# EAGLE design curtains (EAGLE 9.6.2)
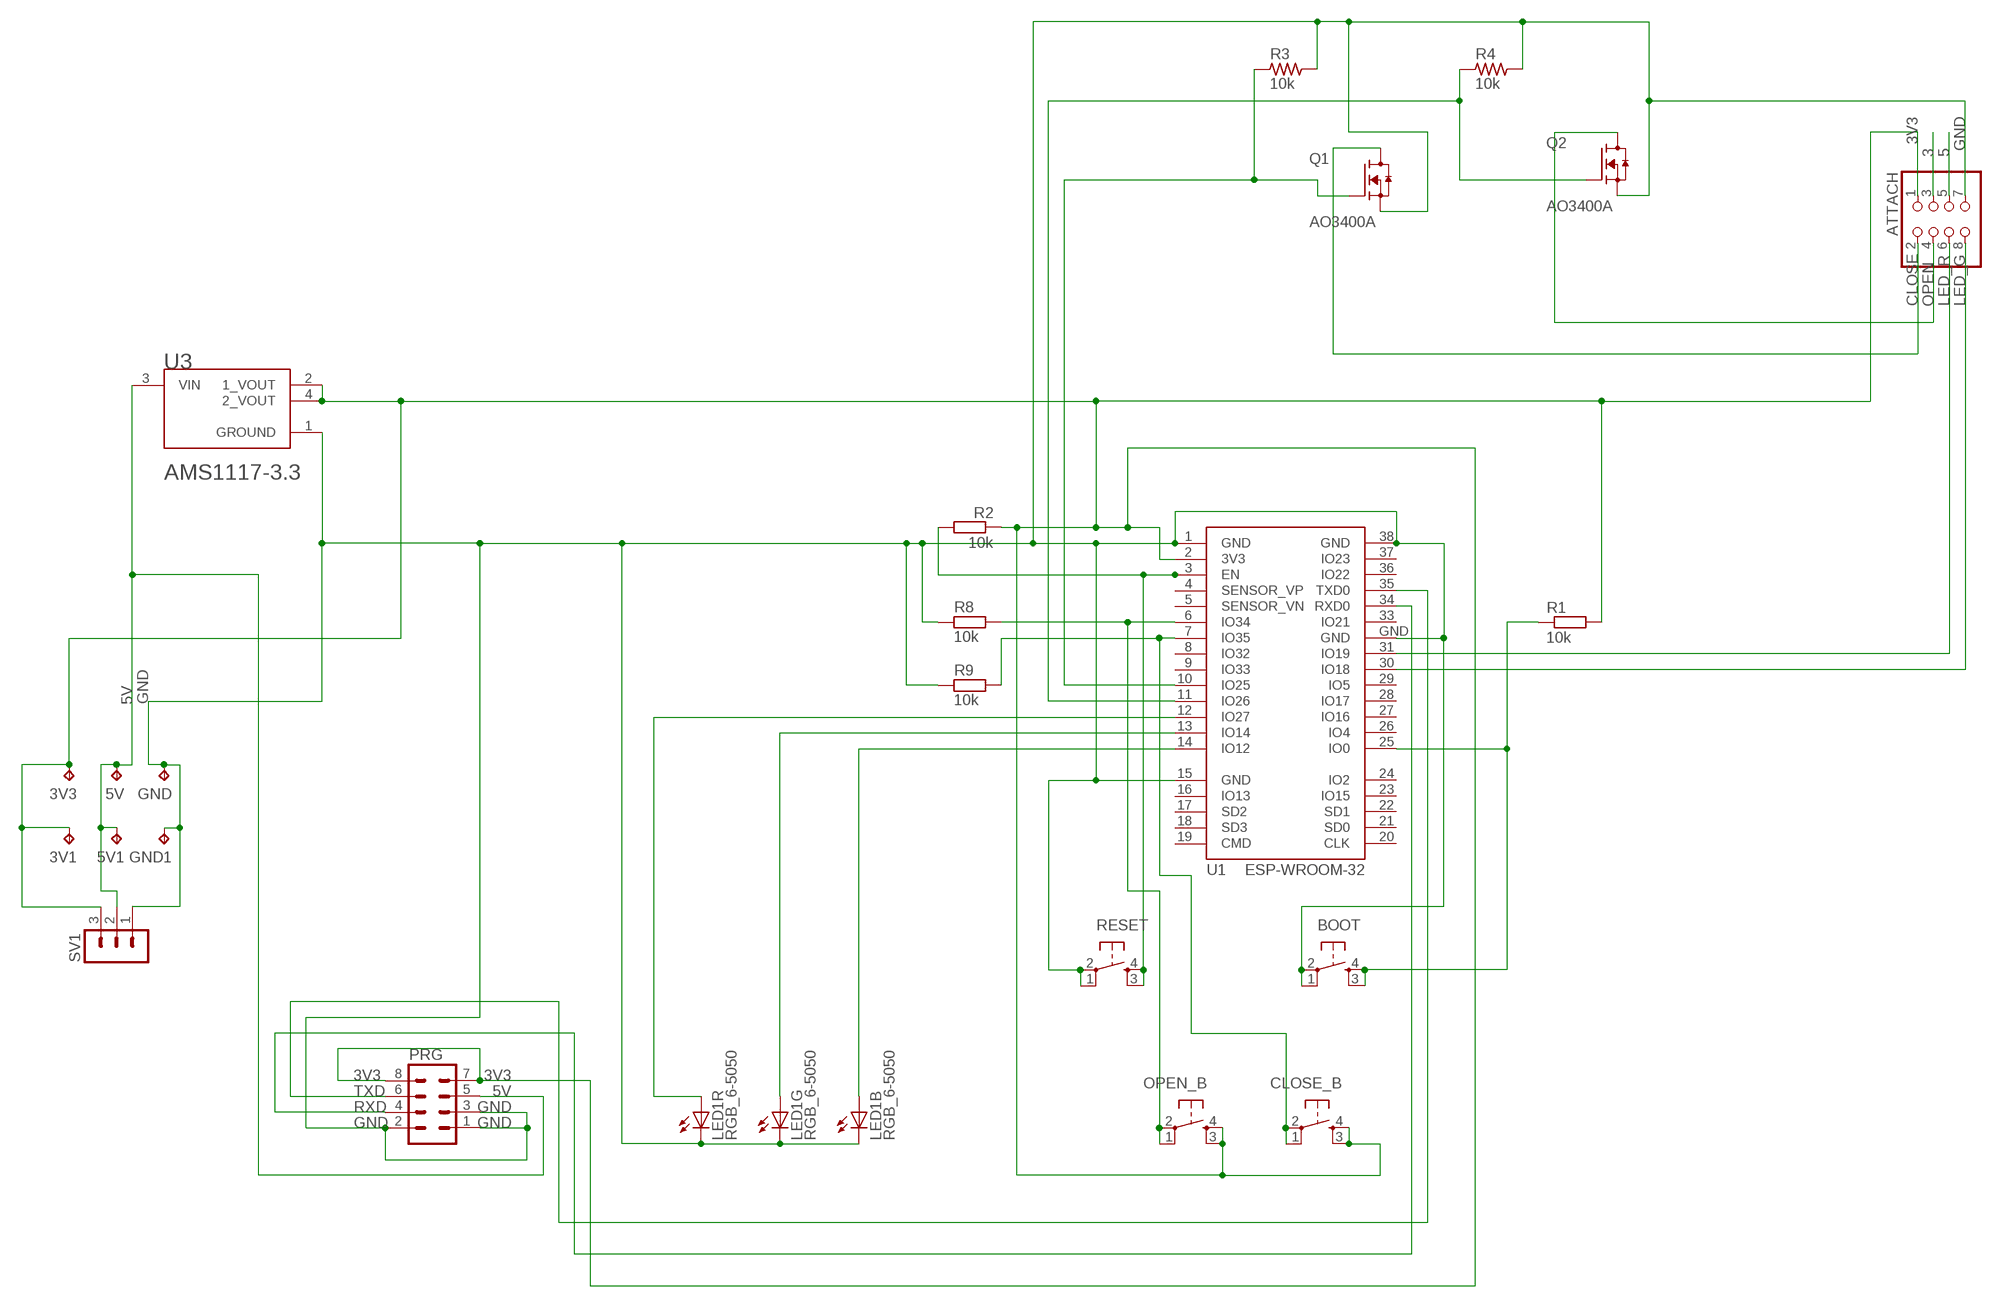
[diagram p0: schematic, sheet 1]

## Parts
3V1  TPB1,27  [B1,27]
3V3  TPB1,27  [B1,27]
5V  TPB1,27  [B1,27]
5V1  TPB1,27  [B1,27]
ATTACH  PINHD-2X4  [2X04]
BOOT  10-XX4X4SMD  [BT4X4]
CLOSE_B  10-XX4X4SMD  [BT4X4]
GND  TPB1,27  [B1,27]
GND1  TPB1,27  [B1,27]
LED1  RGB_6-5050  [5050_PLCC6]
OPEN_B  10-XX4X4SMD  [BT4X4]
PRG  MA04-2  [MA04-2]
Q1  AO3400A  [SOT95P280X125-3N]
Q2  AO3400A  [SOT95P280X125-3N]
R1  10k  R-EU_R0603  [R0603]
R2  10k  R-EU_R0603  [R0603]
R3  10k  RC-MASTER-SMD_R_0603MP  [RC-MASTER-SMD_R0603MP]
R4  10k  RC-MASTER-SMD_R_0603MP  [RC-MASTER-SMD_R0603MP]
R8  10k  R_0603  [R0603]
R9  10k  R_0603  [R0603]
RESET  10-XX4X4SMD  [BT4X4]
SV1  MA03-1  [MA03-1]
U1  ESP-WROOM-32  [ESP-WROOM-32]
U3  ADVANCED_MONOLITHIC_SYSTEMS_AMS1117-3.3ADVANCED_MONOLITHIC_SYSTEMS_AMS1117-3.3_0_0  [ADVANCED_MONOLITHIC_SYSTEMS_AMS1117-3.3_0]

## Nets
3: ATTACH.3
3V3: 3V1.TP 3V3.TP ATTACH.1 CLOSE_B.3(S1) CLOSE_B.4(S) OPEN_B.3(S1) OPEN_B.4(S) PRG.7 PRG.8 R1.2 R2.1 SV1.3 U1.2(3V3) U3.2(1_VOUT) U3.4(2_VOUT)
5: ATTACH.5
5V: 5V1.TP 5V.TP PRG.5 SV1.2 U3.3(VIN)
CLOSE: ATTACH.2 Q1.3(D)
GND: ATTACH.7 BOOT.1 BOOT.2(P) GND1.TP GND.TP LED1.4(B:C) LED1.5(G:C) LED1.6(R:C) PRG.1 PRG.2 PRG.3 Q1.2(S) Q2.2(S) R3.2 R4.2 R8.1 R9.1 RESET.1 RESET.2(P) SV1.1 U1.1(GND) U1.15(GND) U1.38(GND) U1.GND U3.1(GROUND)
LED_G: ATTACH.8 U1.30(IO18)
LED_R: ATTACH.6 U1.31(IO19)
N$1: BOOT.3(S1) BOOT.4(S) R1.1 U1.25(IO0)
N$2: OPEN_B.1 OPEN_B.2(P) R8.2 U1.6(IO34)
N$3: R2.2 RESET.3(S1) RESET.4(S) U1.3(EN)
N$4: Q1.1(G) R3.1 U1.10(IO25)
N$5: Q2.1(G) R4.1 U1.11(IO26)
N$7: LED1.2(G:A) U1.13(IO14)
N$8: LED1.3(B:A) U1.14(IO12)
N$10: CLOSE_B.1 CLOSE_B.2(P) R9.2 U1.7(IO35)
N$11: LED1.1(R:A) U1.12(IO27)
OPEN: ATTACH.4 Q2.3(D)
RXD: PRG.4 U1.34(RXD0)
TXD: PRG.6 U1.35(TXD0)
Unconnected: U1.4(SENSOR_VP) U1.5(SENSOR_VN) U1.8(IO32) U1.9(IO33) U1.16(IO13) U1.17(SD2) U1.18(SD3) U1.19(CMD) U1.20(CLK) U1.21(SD0) U1.22(SD1) U1.23(IO15) U1.24(IO2) U1.26(IO4) U1.27(IO16) U1.28(IO17) U1.29(IO5) U1.33(IO21) U1.36(IO22) U1.37(IO23)

## Library data of the parts
3V1 3V3 5V 5V1 GND GND1 = testpad:TP: Test pad
ATTACH = adafruit:PINHD-2X4: PIN HEADER
BOOT CLOSE_B OPEN_B RESET = buttons:10-XX: OMRON SWITCH
LED1 = led:RGB_6: RGB LED 6000mcd http://tuxotronic.org/mirror/led_rgb/
PRG = con-lstb:MA04-2: PIN HEADER; OC_FARNELL: unknown; OC_NEWARK: unknown
Q1 Q2 = AO3400A:AO3400A: Trans MOSFET N-CH 30V 5.7A 3-Pin SOT-23 Check availability <https://pricing.snapeda.com/parts/AO3400A/Alpha%20%26%20Omega%20Semiconductor%20Inc./view-part?ref=eda>; AVAILABILITY: In Stock; DESCRIPTION: N-Channel 30 V 5.7A (Ta) 1.4W (Ta) Surface Mount SOT-23-3; MF: Alpha & Omega Semiconductor Inc.; MP: AO3400A; PACKAGE: None; PRICE: None; PURCHASE-URL: https://pricing.snapeda.com/search/part/AO3400A/?ref=eda
R1 = resistor:R-EU_: RESISTOR, European symbol
R2 = resistor:R-EU_: RESISTOR, European symbol; RESISTANCE: 10K
R3 R4 = 52101-101-REV-A_v16:RC-MASTER-SMD_R_: RESISTOR
R8 R9 = rc-master:R_: RESISTOR
SV1 = con-lstb:MA03-1: PIN HEADER; OC_FARNELL: unknown; OC_NEWARK: unknown
U1 = esp32:ESP-WROOM-32: Espressif Systems ESP-WROOM-32
U3 = Advanced Monolithic Systems - AMS1117-3.3:ADVANCED_MONOLITHIC_SYSTEMS_AMS1117-3.3: LDO Voltage Regulators 1A, 3.3V; AUTOMOTIVE: No; CENTROID_NOT_SPECIFIED: No; DATASHEET: http://www.advanced-monolithic.com/pdf/ds1117.pdf; DEVICE_CLASS_L1: Integrated Circuits (ICs); DEVICE_CLASS_L2: Power Management ICs; DEVICE_CLASS_L3: Voltage Regulators - Linear; DROPOUT_VOLTAGE: 1.1V; FOOTPRINT_PARAMETERS_0: {"fp_type":"SOT223","params":{"N":{"default":"4","long name":"Number of leads","type":"multichoice","short name":"N"},"A":{"nom":false,"long name":"Height","min":false,"max":1800000,"short name":"A","type":"measurement"},"A1":{"nom":false,"long name":"Standoff height","min":640000,"max":840000,"short name":"A1","type":"measurement"},"A2":{"nom":false,"long name":"Package height","min":1160000,"max":false,"short name":"A2","type":"measurement"},"D":{"nom":false,"long name":"Package length","min":6300000,"max":6710000,"short name":"D","type":"measurement"},"E":{"nom":false,"long name":"Width /w leads","min":6710000,"max":7290000,"short name":"E","type":"measurement"},"E1":{"nom":false,"long name":"Package width","min":3300000,"max":3710000,"short name":"E1","type":"measurement"},"B":{"nom":false,"long name":"Lead width","min":640000,"max":840000,"short name":"B","type":"measurement"},"B2":{"nom":false,"long name":"Thermal lead width","min":2950000,"max":3150000,"short name":"B2","type":"measurement"},"C":{"nom":false,"long name":"Lead thickness","min":250000,"max":360000,"short name":"C","type":"measurement"},"L":{"nom":false,"long name":"Lead foot length","min":310000,"max":false,"short name":"L","type":"measurement"},"e":{"nom":2290000,"long name":"Lead pitch","min":null,"max":null,"short name":"e","type":"measurement"},"PHI":{"nom":false,"long name":"Lead angle","min":false,"max":10000000,"short name":"PHI","type":"measurement"},"offset x":{"nom":0,"long name":"X Center offset","min":null,"max":null,"short name":"offset x","type":"measurement"},"offset y":{"nom":0,"long name":"Y Center offset","min":null,"max":null,"short name":"offset y","type":"measurement"},"LS":{"default":"Rounded rectangle","long name":"Land shape","type":"multichoice","short name":"LS"},"LS1":{"default":"Rectangle","long name":"Land shape (Pin 1)","type":"multichoice","short name":"LS1"},"solder toe":{"nom":550000,"long name":"Solder fillet (toe)","min":null,"max":null,"short name":"solder toe","type":"fixedmeasurement"},"solder heel":{"nom":450000,"long name":"Solder fillet (heel)","min":null,"max":null,"short name":"solder heel","type":"fixedmeasurement"},"solder side":{"nom":50000,"long name":"Solder fillet (side)","min":null,"max":null,"short name":"solder side","type":"fixedmeasurement"},"courtyard":{"nom":500000,"long name":"Courtyard","min":null,"max":null,"short name":"courtyard","type":"fixedmeasurement"},"SF":{"default":"A","long name":"Packing level","type":"multichoiceparent","short name":"SF","help":"http://support.upverter.com/customer/portal/articles/978783-what-is-a-footprint-packing-level","children":["solder toe","solder heel","solder side","courtyard"]}}}; FOOTPRINT_PARAMETERS_1: {"fp_type":"SOT223","params":{"N":{"default":"4","long name":"Number of leads","type":"multichoice","short name":"N"},"A":{"nom":false,"long name":"Height","min":false,"max":1800000,"short name":"A","type":"measurement"},"A1":{"nom":false,"long name":"Standoff height","min":640000,"max":840000,"short name":"A1","type":"measurement"},"A2":{"nom":false,"long name":"Package height","min":1160000,"max":false,"short name":"A2","type":"measurement"},"D":{"nom":false,"long name":"Package length","min":6300000,"max":6710000,"short name":"D","type":"measurement"},"E":{"nom":false,"long name":"Width /w leads","min":6710000,"max":7290000,"short name":"E","type":"measurement"},"E1":{"nom":false,"long name":"Package width","min":3300000,"max":3710000,"short name":"E1","type":"measurement"},"B":{"nom":false,"long name":"Lead width","min":640000,"max":840000,"short name":"B","type":"measurement"},"B2":{"nom":false,"long name":"Thermal lead width","min":2950000,"max":3150000,"short name":"B2","type":"measurement"},"C":{"nom":false,"long name":"Lead thickness","min":250000,"max":360000,"short name":"C","type":"measurement"},"L":{"nom":false,"long name":"Lead foot length","min":310000,"max":false,"short name":"L","type":"measurement"},"e":{"nom":2290000,"long name":"Lead pitch","min":null,"max":null,"short name":"e","type":"measurement"},"PHI":{"nom":false,"long name":"Lead angle","min":false,"max":10000000,"short name":"PHI","type":"measurement"},"offset x":{"nom":0,"long name":"X Center offset","min":null,"max":null,"short name":"offset x","type":"measurement"},"offset y":{"nom":0,"long name":"Y Center offset","min":null,"max":null,"short name":"offset y","type":"measurement"},"LS":{"default":"Rounded rectangle","long name":"Land shape","type":"multichoice","short name":"LS"},"LS1":{"default":"Rectangle","long name":"Land shape (Pin 1)","type":"multichoice","short name":"LS1"},"solder toe":{"nom":350000,"long name":"Solder fillet (toe)","min":null,"max":null,"short name":"solder toe","type":"fixedmeasurement"},"solder heel":{"nom":350000,"long name":"Solder fillet (heel)","min":null,"max":null,"short name":"solder heel","type":"fixedmeasurement"},"solder side":{"nom":30000,"long name":"Solder fillet (side)","min":null,"max":null,"short name":"solder side","type":"fixedmeasurement"},"courtyard":{"nom":250000,"long name":"Courtyard","min":null,"max":null,"short name":"courtyard","type":"fixedmeasurement"},"SF":{"default":"B","long name":"Packing level","type":"multichoiceparent","short name":"SF","help":"http://support.upverter.com/customer/portal/articles/978783-what-is-a-footprint-packing-level","children":["solder toe","solder heel","solder side","courtyard"]}}}; FOOTPRINT_PARAMETERS_2: {"fp_type":"SOT223","params":{"N":{"default":"4","long name":"Number of leads","type":"multichoice","short name":"N"},"A":{"nom":false,"long name":"Height","min":false,"max":1800000,"short name":"A","type":"measurement"},"A1":{"nom":false,"long name":"Standoff height","min":640000,"max":840000,"short name":"A1","type":"measurement"},"A2":{"nom":false,"long name":"Package height","min":1160000,"max":false,"short name":"A2","type":"measurement"},"D":{"nom":false,"long name":"Package length","min":6300000,"max":6710000,"short name":"D","type":"measurement"},"E":{"nom":false,"long name":"Width /w leads","min":6710000,"max":7290000,"short name":"E","type":"measurement"},"E1":{"nom":false,"long name":"Package width","min":3300000,"max":3710000,"short name":"E1","type":"measurement"},"B":{"nom":false,"long name":"Lead width","min":640000,"max":840000,"short name":"B","type":"measurement"},"B2":{"nom":false,"long name":"Thermal lead width","min":2950000,"max":3150000,"short name":"B2","type":"measurement"},"C":{"nom":false,"long name":"Lead thickness","min":250000,"max":360000,"short name":"C","type":"measurement"},"L":{"nom":false,"long name":"Lead foot length","min":310000,"max":false,"short name":"L","type":"measurement"},"e":{"nom":2290000,"long name":"Lead pitch","min":null,"max":null,"short name":"e","type":"measurement"},"PHI":{"nom":false,"long name":"Lead angle","min":false,"max":10000000,"short name":"PHI","type":"measurement"},"offset x":{"nom":0,"long name":"X Center offset","min":null,"max":null,"short name":"offset x","type":"measurement"},"offset y":{"nom":0,"long name":"Y Center offset","min":null,"max":null,"short name":"offset y","type":"measurement"},"LS":{"default":"Rounded rectangle","long name":"Land shape","type":"multichoice","short name":"LS"},"LS1":{"default":"Rectangle","long name":"Land shape (Pin 1)","type":"multichoice","short name":"LS1"},"solder toe":{"nom":150000,"long name":"Solder fillet (toe)","min":null,"max":null,"short name":"solder toe","type":"fixedmeasurement"},"solder heel":{"nom":250000,"long name":"Solder fillet (heel)","min":null,"max":null,"short name":"solder heel","type":"fixedmeasurement"},"solder side":{"nom":10000,"long name":"Solder fillet (side)","min":null,"max":null,"short name":"solder side","type":"fixedmeasurement"},"courtyard":{"nom":100000,"long name":"Courtyard","min":null,"max":null,"short name":"courtyard","type":"fixedmeasurement"},"SF":{"default":"C","long name":"Packing level","type":"multichoiceparent","short name":"SF","help":"http://support.upverter.com/customer/portal/articles/978783-what-is-a-footprint-packing-level","children":["solder toe","solder heel","solder side","courtyard"]}}}; FOOTPRINT_VARIANT_NAME_0: IPC_A; FOOTPRINT_VARIANT_NAME_1: IPC_B; FOOTPRINT_VARIANT_NAME_2: IPC_C; HEIGHT: 1.8mm; IPC_LAND_PATTERN_NAME: SOT229P700X180-4; LEAD_FREE: Yes; MAX_JUNCTION_TEMP: +125°C; MAX_POWER_DISSIPATION: 1.2W; MAX_SUPPLY_VOLTAGE: 15V; MF: Advanced Monolithic Systems; MFG_PACKAGE_IDENT: AMS1117; MFG_PACKAGE_IDENT_DATE: 0; MFG_PACKAGE_IDENT_REV: 0; MPN: AMS1117-3.3; NOMINAL_SUPPLY_CURRENT: 5mA; NUMBER_OF_OUTPUTS: 1; OUTPUT_CURRENT: 1A; OUTPUT_TYPE: Fixed; OUTPUT_VOLTAGE: 3.3V; PACKAGE: SOT223-3; PREFIX: U; ROHS: Yes; STANDOFF_HEIGHT: 0.64mm; TEMPERATURE_RANGE_HIGH: +125°C; TEMPERATURE_RANGE_LOW: -40°C; VERIFICATION_VERSION: 0.0.0.3

## Module ESP
Ports: 

### Library data of the parts

## Board
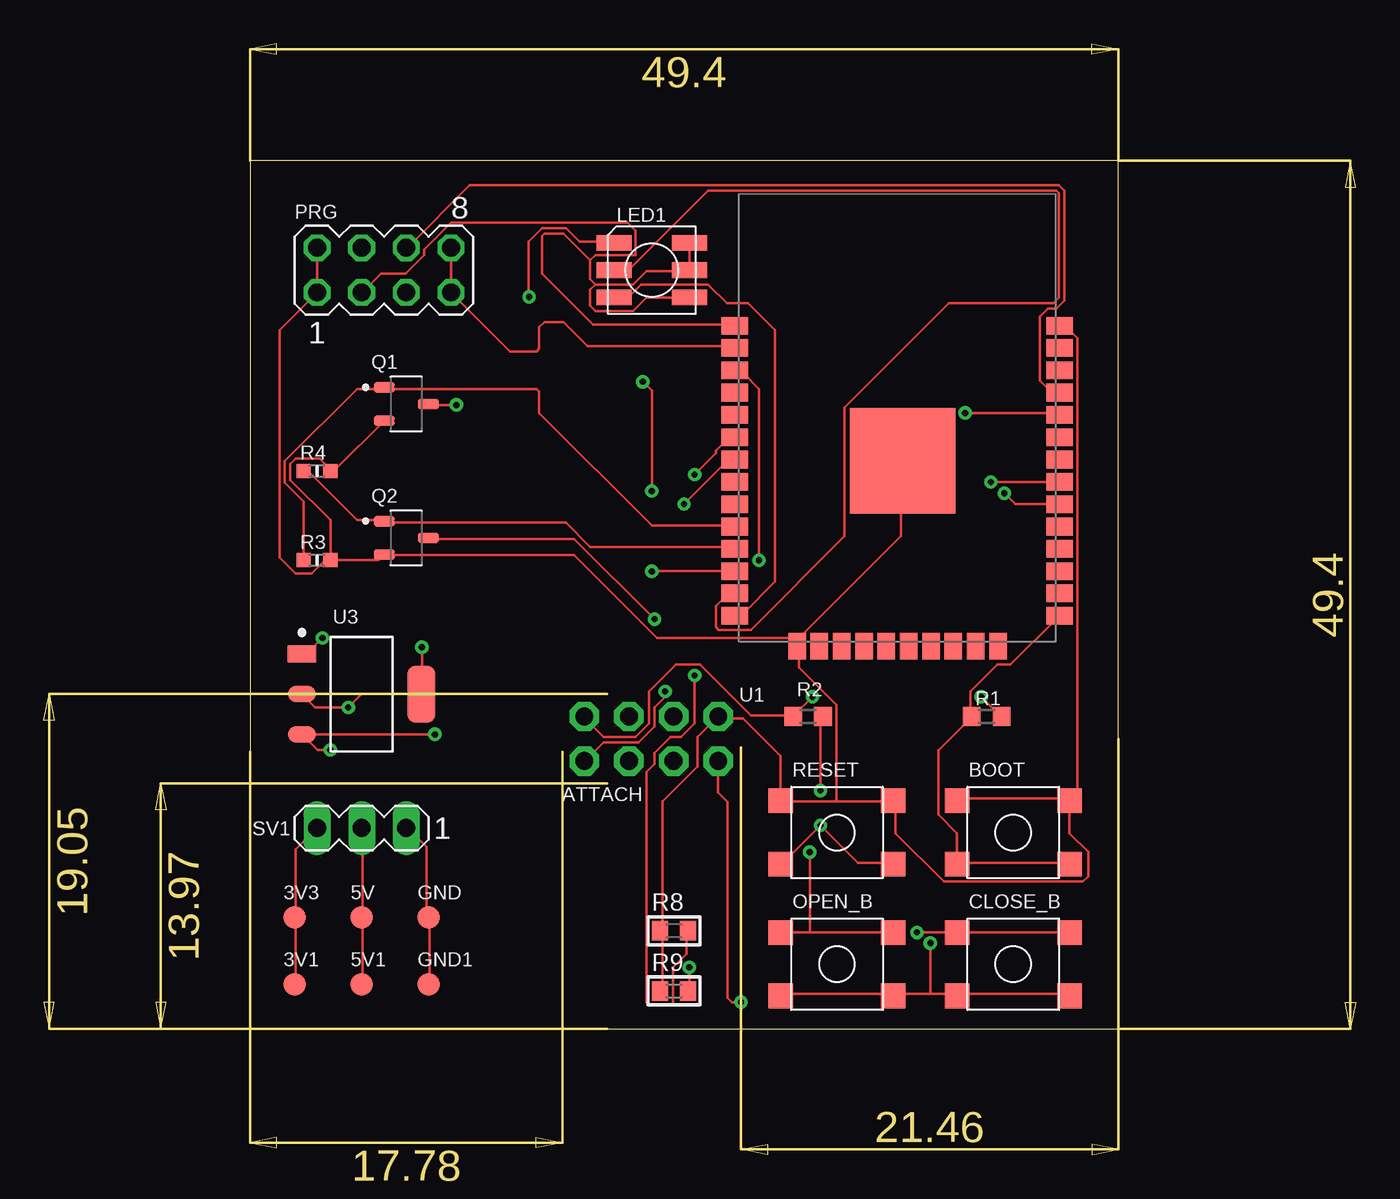
[diagram p1: board, top side]
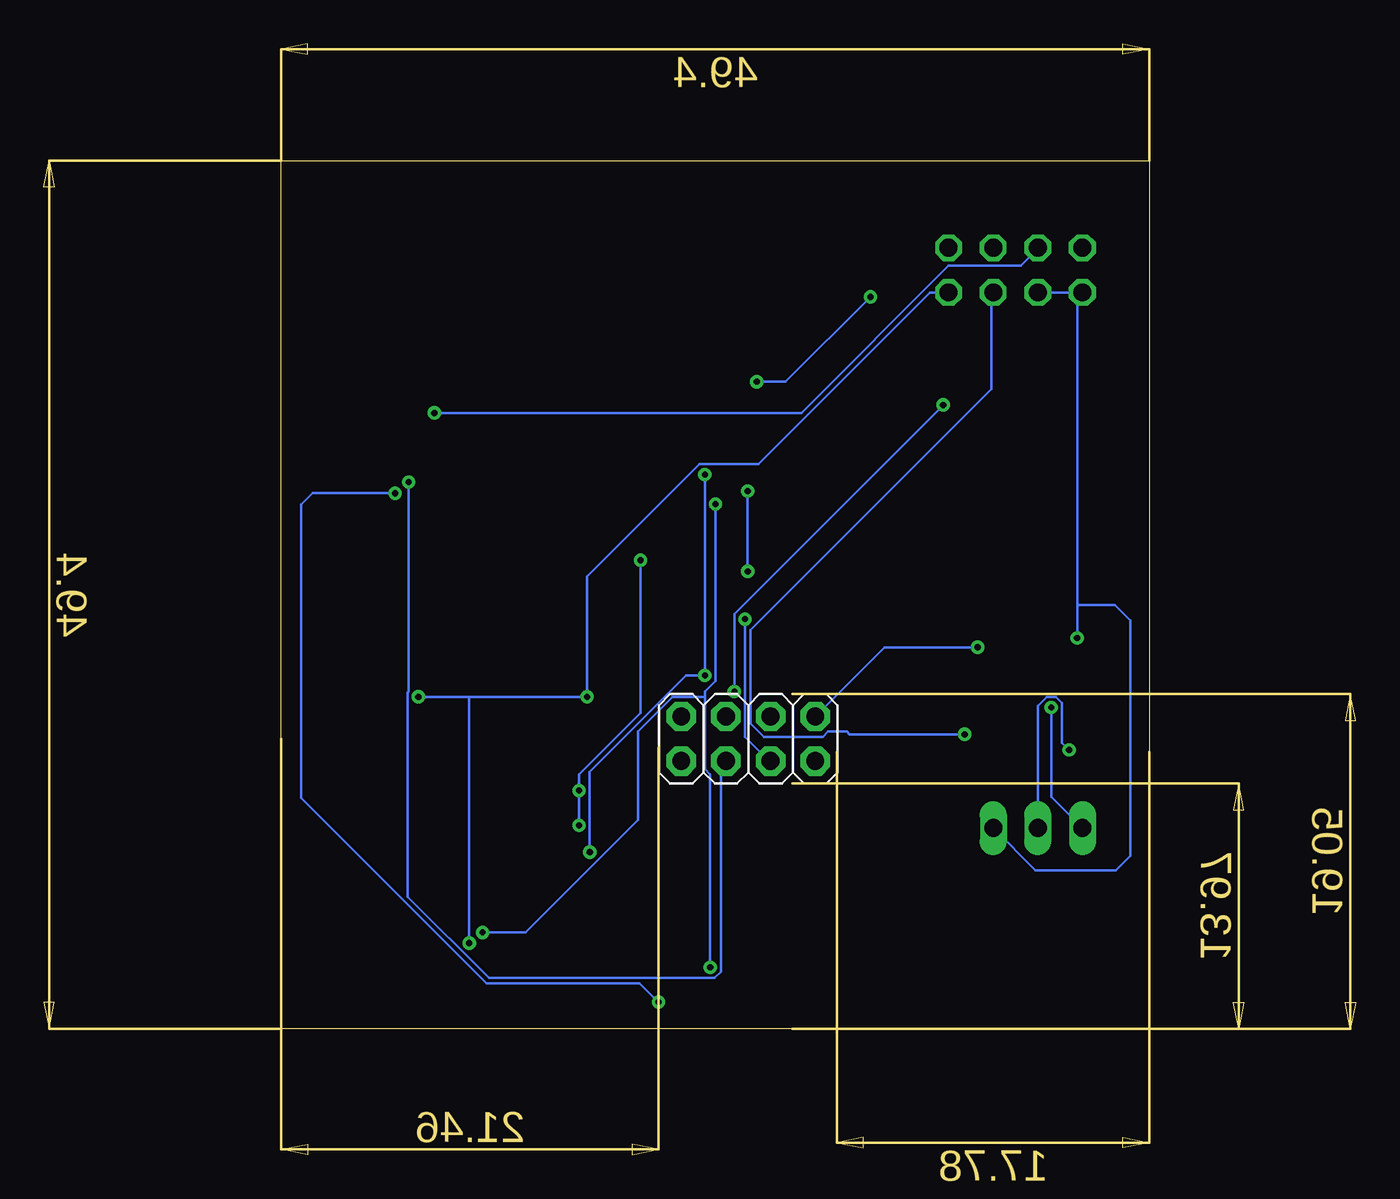
[diagram p2: board, bottom side, seen from below]

Size 49.4 x 49.4 mm. Coordinates in mm from the lower left corner, seen from the top.
Outline: 0,0 49.4,0 49.4,49.4 0,49.4 0,0
Copper layers (1*16): Top 0.035mm / dielectric 1.5mm / Bottom 0.035mm
Design rules "default *": minimum track width 6mil, minimum drill 0.35mm, track to track 6mil, track to pad 6mil, pad to pad 6mil, via to via 6mil, smd to smd 6mil, copper to edge 40mil, drill to drill 6mil, minimum pad ring 10mil, minimum via ring 8mil, stop-mask expansion 4mil, vias tented up to drill 20mil, thermal gap 10mil

### Footprints (pad centres in the part's own frame; a part is rotated, then mirrored left to right if it is on the bottom)
B1,27 = smd 1.27 x 1.27: TP 0,0
2X04 = drill 1.016 pad 1.676 octagon: 1 -3.81,-1.27; 2 -3.81,1.27; 3 -1.27,-1.27; 4 -1.27,1.27; 5 1.27,-1.27; 6 1.27,1.27; 7 3.81,-1.27; 8 3.81,1.27
BT4X4 = smd 1.4 x 1.4: 1 -1.8,3.2; 2 -1.8,-3.2; 3 1.8,3.2; 4 1.8,-3.2
5050_PLCC6 = smd 2 x 0.9: 1 -2.15,1.55; 2 -2.15,0; 3 -2.15,-1.55; 4 2.15,-1.55; 5 2.15,0; 6 2.15,1.55
MA04-2 = drill 1.016 octagon: 1 -3.81,-1.27; 2 -3.81,1.27; 3 -1.27,-1.27; 4 -1.27,1.27; 5 1.27,-1.27; 6 1.27,1.27; 7 3.81,-1.27; 8 3.81,1.27
SOT95P280X125-3N = smd 1.21 x 0.59: 1 -1.255,0.95; 2 -1.255,-0.95; 3 1.255,0
R0603 = smd 1 x 1.1: 1 -0.85,0; 2 0.85,0
RC-MASTER-SMD_R0603MP = smd 0.8 x 0.8: 1 -0.762,0; 2 0.762,0
R0603' = smd 0.9 x 1.1: 1 -0.794,0; 2 0.794,0
MA03-1 = drill 1.016 long: 1 -2.54,0; 2 0,0; 3 2.54,0
ESP-WROOM-32 = smd 1.5 x 1: 1 -9.25,7; 2 -9.25,5.73; 3 -9.25,4.46; 4 -9.25,3.19; 5 -9.25,1.92; 6 -9.25,0.65; 7 -9.25,-0.62; 8 -9.25,-1.89; 9 -9.25,-3.16; 10 -9.25,-4.43; 11 -9.25,-5.7; 12 -9.25,-6.97; 13 -9.25,-8.24; 14 -9.25,-9.51; 25 9.25,-9.51; 26 9.25,-8.24; 27 9.25,-6.97; 28 9.25,-5.7; 29 9.25,-4.43; 30 9.25,-3.16; 31 9.25,-1.89; 32 9.25,-0.62; 33 9.25,0.65; 34 9.25,1.92; 35 9.25,3.19; 36 9.25,4.46; 37 9.25,5.73; 38 9.25,7 | smd 1 x 1.5: 15 -5.7,-11.25; 16 -4.43,-11.25; 17 -3.16,-11.25; 18 -1.89,-11.25; 19 -0.62,-11.25; 20 0.65,-11.25; 21 1.92,-11.25; 22 3.19,-11.25; 23 4.46,-11.25; 24 5.73,-11.25 | smd 6 x 6: GND 0.3,-0.7
ADVANCED_MONOLITHIC_SYSTEMS_AMS1117-3.3_0 = smd 1.604 x 0.952: 1 -3.395,2.29; 2 -3.395,0; 3 -3.395,-2.29 | smd 1.604 x 3.262: 4 3.395,0

### Placement (x,y rotation side)
3V1  2.54,2.54 0 top
3V3  2.54,6.35 0 top
5V  6.35,6.35 0 top
5V1  6.35,2.54 0 top
ATTACH  22.83,16.51 180 bottom
BOOT  43.43,11.18 270 top
CLOSE_B  43.43,3.68 270 top
GND  10.16,6.35 0 top
GND1  10.16,2.54 0 top
LED1  22.86,43.18 0 top
OPEN_B  33.4,3.68 270 top
PRG  7.62,43.18 0 top
Q1  8.89,35.56 0 top
Q2  8.89,27.94 0 top
R1  41.91,17.78 0 top
R2  31.75,17.78 0 top
R3  3.81,26.67 0 top
R4  3.81,31.75 0 top
R8  10k  [R0603']  24.13,5.59 0 top
R9  10k  [R0603']  24.13,2.16 0 top
RESET  33.4,11.18 270 top
SV1  6.35,11.43 180 top
U1  36.83,33.02 0 top
U3  6.35,19.05 0 top

### Tracks (layer width: path | path; a pad name or v marks a point on that pad's centre or on a via)
3V3  (via drill 0.35)
  Top 0.152: U1.2 27.43,38.86 19.2,38.86 17.83,40.23 16.76,40.23 16.46,39.93 16.46,38.71 16.31,38.56 14.78,38.56 PRG.7 PRG.8 | OPEN_B.4 30.33,1.98 36.58,1.98 OPEN_B.3 36.73,1.98 38.71,1.98 | 38.71,1.98 40.23,1.98 CLOSE_B.4 40.39,1.98 46.48,1.98 CLOSE_B.3 | ATTACH.1 19.05,17.68 20.12,16.61 21.95,16.61 22.71,17.37 22.71,19.2 24.23,20.73 25.6,20.73 28.5,17.83 30.79,17.83 R2.1 30.94,17.83 v32,18.9 | v41.6,18.9 42.67,17.83 R1.2 | v38.71,4.88 38.71,1.98 | 3V1.TP 2.59,2.59 2.59,6.25 3V3.TP 2.59,6.4 2.59,10.21 SV1.3 | v9.78,21.72 9.78,19.08 U3.4 6.35,19.05 v5.59,18.29 3.72,18.29 U3.2
  Bottom 0.152: 38.71,18.9 v32,18.9 32,25.76 25.6,32.16 22.25,32.16 12.5,41.91 PRG.7 | 38.71,18.9 v41.6,18.9 | 38.71,18.9 v38.71,4.88 | ATTACH.1 15.08,21.72 v9.78,21.72 | v5.59,18.29 5.59,13.21 SV1.3
5V  (via drill 0.35)
  Top 0.152: 5V1.TP 6.4,2.59 6.4,6.25 5V.TP 6.4,6.4 6.4,11.43 SV1.2 | v10.52,16.76 3.05,16.76 U3.3 3.84,15.88 v4.57,15.88
  Bottom 0.152: v10.52,16.76 17.07,16.76 17.22,16.92 18.29,16.92 18.59,16.61 21.95,16.61 22.71,17.37 22.71,22.71 8.99,36.42 8.99,41.91 PRG.5 | v4.57,15.88 4.98,16.28 4.98,18.54 5.34,18.89 5.84,18.89 6.35,18.38 SV1.2
CLOSE  (via drill 0.35)
  Top 0.152: v11.73,35.51 10.21,35.51 Q1.3 | v23.62,19.2 23.62,18.9 23.01,18.29 23.01,17.22 22.1,16.31 20.12,16.31 19.05,15.24 ATTACH.2
  Bottom 0.152: v11.73,35.51 23.62,23.62 v23.62,19.2
GND  (via drill 0.35)
  Top 0.152: R3.2 7.32,26.67 7.62,26.98 Q2.2 7.77,26.98 18.44,26.98 23.16,22.25 31.24,22.25 | 4.57,31.85 4.88,31.85 7.62,34.59 Q1.2 7.77,34.75 | R3.2 4.57,28.96 2.29,31.24 2.29,32.16 2.59,32.46 3.96,32.46 4.57,31.85 | 4.57,31.85 R4.2 | 19.36,43.74 17.83,45.26 16.76,45.26 16.61,45.11 16.61,42.98 19.51,40.08 27.43,40.08 U1.1 | 19.36,43.74 19.36,42.67 19.66,42.37 | 19.66,42.37 21.79,42.37 22.55,43.13 24.99,43.13 LED1.5 24.99,43.28 24.99,44.65 LED1.6 | 19.66,42.37 19.36,42.06 19.36,41.15 19.66,40.84 21.79,40.84 22.55,41.6 24.99,41.6 LED1.4 | v4.12,22.25 3.35,21.49 3.05,21.49 U3.1 | PRG.2 PRG.1 1.68,39.78 1.68,26.82 2.59,25.91 3.5,25.91 4.27,26.67 R3.2 | 19.36,43.74 19.66,44.04 21.95,44.04 21.95,45.41 21.49,45.87 11.43,45.87 9.91,44.35 9.91,44.04 8.84,42.98 7.47,42.98 6.4,41.91 PRG.3 | BOOT.2 40.39,13.11 46.48,13.11 BOOT.1 | U1.38 46.18,39.93 46.48,39.93 47.09,39.32 47.09,13.56 46.63,13.11 BOOT.1 | R9.1 23.47,2.29 23.47,5.49 R8.1 23.47,5.64 23.47,12.95 25.45,14.94 25.45,16.61 26.52,17.68 ATTACH.7 26.67,17.68 28.04,17.68 30.18,15.54 30.18,13.11 RESET.2 30.33,12.95 33.38,12.95 | 33.38,12.95 36.58,12.95 RESET.1 36.73,12.95 36.73,11.12 39.47,8.38 47.4,8.38 47.7,8.69 47.7,10.06 46.63,11.12 46.63,12.95 BOOT.1 | 33.38,12.95 33.38,18.44 31.24,20.57 31.24,21.64 U1.15 | 31.24,22.25 37.03,28.04 37.03,32.31 U1.GND | 31.24,22.25 31.24,21.79 U1.15 | 31.24,22.25 U1.15 | GND1.TP 10.21,2.59 10.21,6.25 GND.TP 10.06,6.4 10.06,10.36 8.99,11.43 SV1.1
  Bottom 0.152: 4.12,41.6 4.12,24.13 | 4.12,24.13 v4.12,22.25 | PRG.3 4.42,41.91 4.12,41.6 | 4.12,41.6 PRG.1 | 4.12,24.13 1.98,24.13 1.09,23.24 1.09,9.83 1.91,9.02 6.48,9.02 SV1.1
LED_G  (via drill 0.35)
  Top 0.152: ATTACH.8 26.64,13.46 27.18,12.92 27.18,1.78 27.43,1.52 v27.94,1.52 | v42.93,30.48 43.55,29.86 U1.30
  Bottom 0.152: v27.94,1.52 29.01,2.59 37.72,2.59 48.26,13.14 48.26,29.84 47.62,30.48 v42.93,30.48
LED_R  (via drill 0.35)
  Top 0.152: v42.16,31.11 46.06,31.11 U1.31
  Bottom 0.152: ATTACH.6 24.39,14.95 24.39,3.25 24.74,2.9 37.59,2.9 42.21,7.52 42.21,19.15 42.16,19.2 v42.16,31.11
N$1
  Top 0.152: BOOT.3 46.48,9.45 40.39,9.45 BOOT.4 40.23,9.45 40.23,11.12 39.17,12.19 39.17,15.85 41,17.68 R1.1 41,17.83 41,19.2 42.52,20.73 43.28,20.73 46.02,23.47 U1.25
N$2  (via drill 0.35)
  Top 0.152: 31.85,5.49 36.58,5.49 OPEN_B.1 | 31.85,5.49 30.33,5.49 OPEN_B.2 | v25.3,20.12 25.3,17.37 24.54,16.61 23.93,16.61 23.01,15.7 23.01,15.09 22.55,14.63 22.55,1.52 22.71,1.37 23.93,1.37 24.08,1.52 24.08,3.5 24.84,4.27 24.84,5.49 R8.2 | v25.3,31.55 26.52,32.77 26.52,32.92 27.13,33.53 27.43,33.53 U1.6 | v31.85,10.06 31.85,5.49
  Bottom 0.152: v25.3,31.55 v25.3,20.12 26.36,20.12 31.85,14.63 v31.85,10.06
N$3  (via drill 0.35)
  Top 0.152: v32.46,13.56 32.46,17.68 R2.2 | RESET.4 30.33,9.45 v32.46,11.58 34.59,9.45 36.58,9.45 RESET.3 | v28.96,26.67 28.96,36.42 28.04,37.34 27.58,37.34 U1.3
  Bottom 0.152: v32.46,11.58 v32.46,13.56 32.46,14.48 28.96,17.98 v28.96,26.67
N$4
  Top 0.152: R3.1 3.05,30.02 1.98,31.09 1.98,32.31 6.1,36.42 7.62,36.42 Q1.1 7.77,36.42 16.31,36.42 16.46,36.27 16.46,35.05 22.86,28.65 27.43,28.65 U1.10
N$5
  Top 0.152: R4.1 3.05,31.7 3.35,31.7 6.1,28.96 7.62,28.96 Q2.1 7.77,28.8 17.98,28.8 19.36,27.43 27.43,27.43 U1.11
N$7
  Top 0.152: U1.13 27.43,24.69 27.13,24.69 26.52,24.08 26.52,22.86 26.67,22.71 28.5,22.71 33.83,28.04 33.83,35.36 39.78,41.3 45.72,41.3 46.02,41.6 46.02,47.55 45.87,47.7 26.06,47.7 21.64,43.28 20.73,43.28 LED1.2
N$8
  Top 0.152: U1.14 27.58,23.62 28.04,23.62 29.87,25.45 29.87,39.78 28.35,41.3 27.13,41.3 26.06,42.37 22.25,42.37 21.64,41.76 20.73,41.76 LED1.3
N$10  (via drill 0.35)
  Top 0.152: CLOSE_B.1 46.48,5.49 40.39,5.49 CLOSE_B.2 v37.95,5.49 | v24.99,3.5 24.99,2.29 R9.2 | v24.69,29.87 27.13,32.31 27.43,32.31 U1.7
  Bottom 0.152: v24.99,3.5 24.99,14.48 25.3,14.78 25.3,18.9 | 25.3,18.9 25.3,19.2 24.69,19.81 v24.69,29.87 | v37.95,5.49 35.51,5.49 29.11,11.89 29.11,16.92 27.13,18.9 25.3,18.9
N$11  (via drill 0.35)
  Top 0.152: LED1.1 20.57,44.81 18.75,44.81 17.98,45.57 16.61,45.57 15.85,44.81 15.85,41.68 v15.88,41.66 | v22.35,36.83 22.86,36.32 v22.86,30.61 | v22.86,26.04 22.88,26.05 U1.12
  Bottom 0.152: v15.88,41.66 20.7,36.83 v22.35,36.83 | v22.86,30.61 v22.86,26.04
OPEN  (via drill 0.35)
  Top 0.152: v23.01,23.32 18.44,27.89 10.21,27.89 Q2.3
  Bottom 0.152: v23.01,23.32 23.01,16.61 21.64,15.24 ATTACH.4
RXD  (via drill 0.35)
  Top 0.152: v40.69,35.05 46.02,35.05 U1.34
  Bottom 0.152: v40.69,35.05 19.81,35.05 11.43,43.43 7.32,43.43 6.4,44.35 PRG.4
TXD
  Top 0.152: U1.35 46.02,36.27 45.57,36.27 44.96,36.88 44.96,40.54 45.41,41 45.87,41 46.33,41.45 46.33,47.7 46.02,48.01 12.5,48.01 8.99,44.5 PRG.6